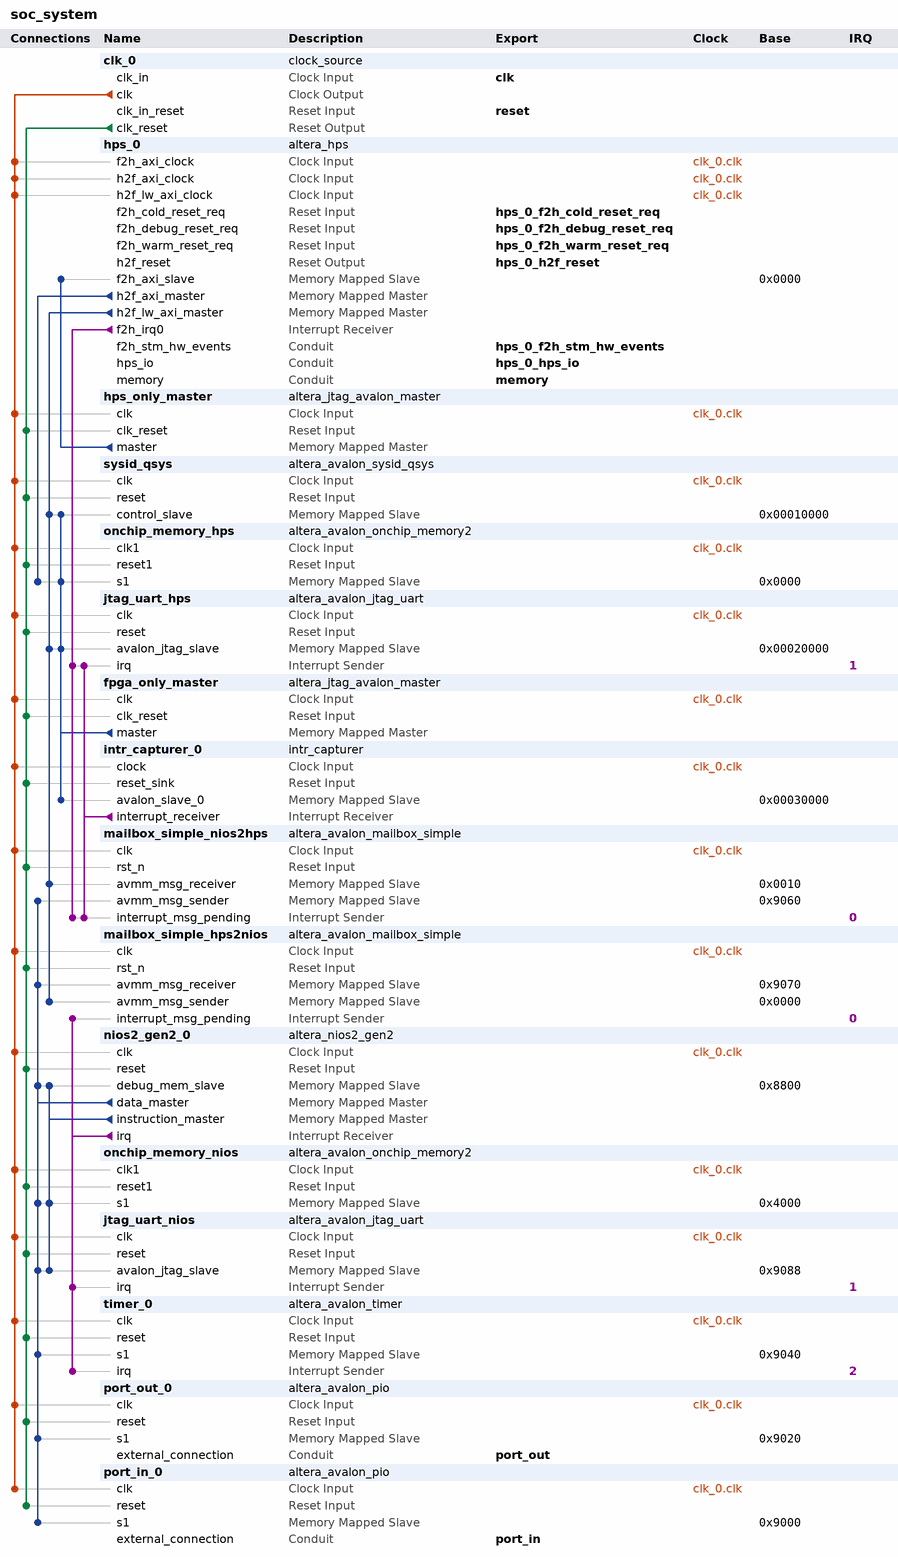
[diagram p0: system contents]
# Platform Designer (Qsys) system soc_system, Cyclone V 5CSEMA4U23C6
# Parameters at their usual value, and those the tool derives, are not listed.
package require -exact qsys 15.1
create_system soc_system
set_project_property DEVICE_FAMILY {Cyclone V}
set_project_property DEVICE 5CSEMA4U23C6

add_instance clk_0 clock_source 15.1
set_instance_parameter_value clk_0 clockFrequency 50000000

add_instance hps_0 altera_hps 15.1
set_instance_parameter_value hps_0 EMAC1_Mode RGMII
set_instance_parameter_value hps_0 EMAC1_PinMuxing {HPS I/O Set 0}
set_instance_parameter_value hps_0 F2SCLK_COLDRST_Enable true
set_instance_parameter_value hps_0 F2SCLK_DBGRST_Enable true
set_instance_parameter_value hps_0 F2SCLK_WARMRST_Enable true
set_instance_parameter_value hps_0 F2SINTERRUPT_Enable true
set_instance_parameter_value hps_0 F2S_Width 3
set_instance_parameter_value hps_0 FPGA_PERIPHERAL_OUTPUT_CLOCK_FREQ_EMAC0_GTX_CLK 100
set_instance_parameter_value hps_0 FPGA_PERIPHERAL_OUTPUT_CLOCK_FREQ_EMAC0_MD_CLK 100.0
set_instance_parameter_value hps_0 FPGA_PERIPHERAL_OUTPUT_CLOCK_FREQ_EMAC1_GTX_CLK 100
set_instance_parameter_value hps_0 FPGA_PERIPHERAL_OUTPUT_CLOCK_FREQ_EMAC1_MD_CLK 100.0
set_instance_parameter_value hps_0 HPS_PROTOCOL DDR3
set_instance_parameter_value hps_0 I2C0_Mode I2C
set_instance_parameter_value hps_0 I2C0_PinMuxing {HPS I/O Set 0}
set_instance_parameter_value hps_0 I2C1_Mode I2C
set_instance_parameter_value hps_0 I2C1_PinMuxing {HPS I/O Set 0}
set_instance_parameter_value hps_0 LWH2F_Enable true
set_instance_parameter_value hps_0 MEM_BANKADDR_WIDTH 3
set_instance_parameter_value hps_0 MEM_CLK_FREQ 400.0
set_instance_parameter_value hps_0 MEM_COL_ADDR_WIDTH 10
set_instance_parameter_value hps_0 MEM_DQ_WIDTH 32
set_instance_parameter_value hps_0 MEM_DRV_STR RZQ/6
set_instance_parameter_value hps_0 MEM_ROW_ADDR_WIDTH 15
set_instance_parameter_value hps_0 MEM_RTT_NOM RZQ/6
set_instance_parameter_value hps_0 MEM_RTT_WR {Dynamic ODT off}
set_instance_parameter_value hps_0 MEM_TCL 7
set_instance_parameter_value hps_0 MEM_TFAW_NS 37.5
set_instance_parameter_value hps_0 MEM_TRAS_NS 35.0
set_instance_parameter_value hps_0 MEM_TRCD_NS 13.75
set_instance_parameter_value hps_0 MEM_TRFC_NS 300.0
set_instance_parameter_value hps_0 MEM_TRP_NS 13.75
set_instance_parameter_value hps_0 MEM_VENDOR Other
set_instance_parameter_value hps_0 MEM_WTCL 7
set_instance_parameter_value hps_0 QSPI_Mode N/A
set_instance_parameter_value hps_0 QSPI_PinMuxing Unused
set_instance_parameter_value hps_0 REF_CLK_FREQ 25.0
set_instance_parameter_value hps_0 S2FCLK_USER2CLK 1
set_instance_parameter_value hps_0 S2F_Width 2
set_instance_parameter_value hps_0 SDIO_Mode {4-bit Data}
set_instance_parameter_value hps_0 SDIO_PinMuxing {HPS I/O Set 0}
set_instance_parameter_value hps_0 SPIM1_Mode {Single Slave Select}
set_instance_parameter_value hps_0 SPIM1_PinMuxing {HPS I/O Set 0}
set_instance_parameter_value hps_0 STM_Enable true
set_instance_parameter_value hps_0 TIMING_BOARD_AC_SKEW 0.02
set_instance_parameter_value hps_0 TIMING_BOARD_AC_TO_CK_SKEW 0.0
set_instance_parameter_value hps_0 TIMING_BOARD_DQ_TO_DQS_SKEW 0.0
set_instance_parameter_value hps_0 TIMING_BOARD_MAX_CK_DELAY 0.6
set_instance_parameter_value hps_0 TIMING_BOARD_MAX_DQS_DELAY 0.6
set_instance_parameter_value hps_0 TIMING_BOARD_SKEW_BETWEEN_DQS 0.02
set_instance_parameter_value hps_0 TIMING_BOARD_SKEW_CKDQS_DIMM_MAX 0.01
set_instance_parameter_value hps_0 TIMING_BOARD_SKEW_CKDQS_DIMM_MIN -0.01
set_instance_parameter_value hps_0 TIMING_BOARD_SKEW_WITHIN_DQS 0.02
set_instance_parameter_value hps_0 TIMING_TDH 125
set_instance_parameter_value hps_0 TIMING_TDQSCK 400
set_instance_parameter_value hps_0 TIMING_TDQSQ 120
set_instance_parameter_value hps_0 TIMING_TDS 50
set_instance_parameter_value hps_0 TIMING_TIH 250
set_instance_parameter_value hps_0 TIMING_TIS 175
set_instance_parameter_value hps_0 TIMING_TQSH 0.38
set_instance_parameter_value hps_0 UART0_Mode {No Flow Control}
set_instance_parameter_value hps_0 UART0_PinMuxing {HPS I/O Set 0}
set_instance_parameter_value hps_0 USB1_Mode SDR
set_instance_parameter_value hps_0 USB1_PinMuxing {HPS I/O Set 0}
set_instance_parameter_value hps_0 desired_cfg_clk_mhz 100.0
set_instance_parameter_value hps_0 desired_qspi_clk_mhz 370.0

add_instance hps_only_master altera_jtag_avalon_master 15.1

add_instance sysid_qsys altera_avalon_sysid_qsys 15.1
set_instance_parameter_value sysid_qsys id -1395322110

add_instance onchip_memory_hps altera_avalon_onchip_memory2 15.1
set_instance_parameter_value onchip_memory_hps dataWidth 64
set_instance_parameter_value onchip_memory_hps dualPort false
set_instance_parameter_value onchip_memory_hps initMemContent true
set_instance_parameter_value onchip_memory_hps initializationFileName onchip_memory2_0
set_instance_parameter_value onchip_memory_hps memorySize 65536

add_instance jtag_uart_hps altera_avalon_jtag_uart 15.1
set_instance_parameter_value jtag_uart_hps allowMultipleConnections true
set_instance_parameter_value jtag_uart_hps simInteractiveOptions INTERACTIVE_ASCII_OUTPUT

add_instance fpga_only_master altera_jtag_avalon_master 15.1

add_instance intr_capturer_0 intr_capturer 100.99.98.97

add_instance mailbox_simple_nios2hps altera_avalon_mailbox_simple 15.1
set_instance_parameter_value mailbox_simple_nios2hps AWIDTH 2
set_instance_parameter_value mailbox_simple_nios2hps DWIDTH 32
set_instance_parameter_value mailbox_simple_nios2hps MSG_ARRIVAL_NOTIFY 1
set_instance_parameter_value mailbox_simple_nios2hps MSG_SPACE_NOTIFY 0

add_instance mailbox_simple_hps2nios altera_avalon_mailbox_simple 15.1
set_instance_parameter_value mailbox_simple_hps2nios AWIDTH 2
set_instance_parameter_value mailbox_simple_hps2nios DWIDTH 32
set_instance_parameter_value mailbox_simple_hps2nios MSG_ARRIVAL_NOTIFY 1
set_instance_parameter_value mailbox_simple_hps2nios MSG_SPACE_NOTIFY 0

add_instance nios2_gen2_0 altera_nios2_gen2 15.1
set_instance_parameter_value nios2_gen2_0 dcache_size 2048
set_instance_parameter_value nios2_gen2_0 exceptionSlave onchip_memory_nios.s1
set_instance_parameter_value nios2_gen2_0 icache_size 4096
set_instance_parameter_value nios2_gen2_0 impl Fast
set_instance_parameter_value nios2_gen2_0 resetSlave onchip_memory_nios.s1

add_instance onchip_memory_nios altera_avalon_onchip_memory2 15.1
set_instance_parameter_value onchip_memory_nios dataWidth 32
set_instance_parameter_value onchip_memory_nios dualPort false
set_instance_parameter_value onchip_memory_nios initMemContent true
set_instance_parameter_value onchip_memory_nios initializationFileName /home/user/hps-nios-fpga/software/soc_nios/soc_nios.hex
set_instance_parameter_value onchip_memory_nios memorySize 16384
set_instance_parameter_value onchip_memory_nios useNonDefaultInitFile true

add_instance jtag_uart_nios altera_avalon_jtag_uart 15.1
set_instance_parameter_value jtag_uart_nios simInteractiveOptions NO_INTERACTIVE_WINDOWS

add_instance timer_0 altera_avalon_timer 15.1
set_instance_parameter_value timer_0 period 100
set_instance_parameter_value timer_0 periodUnits MSEC

add_instance port_out_0 altera_avalon_pio 15.1
set_instance_parameter_value port_out_0 bitModifyingOutReg true
set_instance_parameter_value port_out_0 direction Output
set_instance_parameter_value port_out_0 width 8

add_instance port_in_0 altera_avalon_pio 15.1
set_instance_parameter_value port_in_0 bitModifyingOutReg true
set_instance_parameter_value port_in_0 direction Input
set_instance_parameter_value port_in_0 width 8

# connections
add_connection clk_0.clk fpga_only_master.clk clock
add_connection clk_0.clk hps_0.f2h_axi_clock clock
add_connection clk_0.clk hps_0.h2f_axi_clock clock
add_connection clk_0.clk hps_0.h2f_lw_axi_clock clock
add_connection clk_0.clk hps_only_master.clk clock
add_connection clk_0.clk intr_capturer_0.clock clock
add_connection clk_0.clk jtag_uart_hps.clk clock
add_connection clk_0.clk jtag_uart_nios.clk clock
add_connection clk_0.clk mailbox_simple_hps2nios.clk clock
add_connection clk_0.clk mailbox_simple_nios2hps.clk clock
add_connection clk_0.clk nios2_gen2_0.clk clock
add_connection clk_0.clk onchip_memory_hps.clk1 clock
add_connection clk_0.clk onchip_memory_nios.clk1 clock
add_connection clk_0.clk port_in_0.clk clock
add_connection clk_0.clk port_out_0.clk clock
add_connection clk_0.clk sysid_qsys.clk clock
add_connection clk_0.clk timer_0.clk clock
add_connection clk_0.clk_reset fpga_only_master.clk_reset reset
add_connection clk_0.clk_reset hps_only_master.clk_reset reset
add_connection clk_0.clk_reset intr_capturer_0.reset_sink reset
add_connection clk_0.clk_reset jtag_uart_hps.reset reset
add_connection clk_0.clk_reset jtag_uart_nios.reset reset
add_connection clk_0.clk_reset mailbox_simple_hps2nios.rst_n reset
add_connection clk_0.clk_reset mailbox_simple_nios2hps.rst_n reset
add_connection clk_0.clk_reset nios2_gen2_0.reset reset
add_connection clk_0.clk_reset onchip_memory_hps.reset1 reset
add_connection clk_0.clk_reset onchip_memory_nios.reset1 reset
add_connection clk_0.clk_reset port_in_0.reset reset
add_connection clk_0.clk_reset port_out_0.reset reset
add_connection clk_0.clk_reset sysid_qsys.reset reset
add_connection clk_0.clk_reset timer_0.reset reset
add_connection fpga_only_master.master intr_capturer_0.avalon_slave_0 avalon
set_connection_parameter_value fpga_only_master.master/intr_capturer_0.avalon_slave_0 baseAddress 0x00030000
add_connection fpga_only_master.master jtag_uart_hps.avalon_jtag_slave avalon
set_connection_parameter_value fpga_only_master.master/jtag_uart_hps.avalon_jtag_slave baseAddress 0x00020000
add_connection fpga_only_master.master onchip_memory_hps.s1 avalon
set_connection_parameter_value fpga_only_master.master/onchip_memory_hps.s1 baseAddress 0x0000
add_connection fpga_only_master.master sysid_qsys.control_slave avalon
set_connection_parameter_value fpga_only_master.master/sysid_qsys.control_slave baseAddress 0x00010000
add_connection hps_0.h2f_axi_master onchip_memory_hps.s1 avalon
set_connection_parameter_value hps_0.h2f_axi_master/onchip_memory_hps.s1 baseAddress 0x0000
add_connection hps_0.h2f_lw_axi_master jtag_uart_hps.avalon_jtag_slave avalon
set_connection_parameter_value hps_0.h2f_lw_axi_master/jtag_uart_hps.avalon_jtag_slave baseAddress 0x00020000
add_connection hps_0.h2f_lw_axi_master mailbox_simple_hps2nios.avmm_msg_sender avalon
set_connection_parameter_value hps_0.h2f_lw_axi_master/mailbox_simple_hps2nios.avmm_msg_sender baseAddress 0x0000
add_connection hps_0.h2f_lw_axi_master mailbox_simple_nios2hps.avmm_msg_receiver avalon
set_connection_parameter_value hps_0.h2f_lw_axi_master/mailbox_simple_nios2hps.avmm_msg_receiver baseAddress 0x0010
add_connection hps_0.h2f_lw_axi_master sysid_qsys.control_slave avalon
set_connection_parameter_value hps_0.h2f_lw_axi_master/sysid_qsys.control_slave baseAddress 0x00010000
add_connection hps_only_master.master hps_0.f2h_axi_slave avalon
set_connection_parameter_value hps_only_master.master/hps_0.f2h_axi_slave baseAddress 0x0000
add_connection nios2_gen2_0.data_master jtag_uart_nios.avalon_jtag_slave avalon
set_connection_parameter_value nios2_gen2_0.data_master/jtag_uart_nios.avalon_jtag_slave baseAddress 0x9088
add_connection nios2_gen2_0.data_master mailbox_simple_hps2nios.avmm_msg_receiver avalon
set_connection_parameter_value nios2_gen2_0.data_master/mailbox_simple_hps2nios.avmm_msg_receiver baseAddress 0x9070
add_connection nios2_gen2_0.data_master mailbox_simple_nios2hps.avmm_msg_sender avalon
set_connection_parameter_value nios2_gen2_0.data_master/mailbox_simple_nios2hps.avmm_msg_sender baseAddress 0x9060
add_connection nios2_gen2_0.data_master nios2_gen2_0.debug_mem_slave avalon
set_connection_parameter_value nios2_gen2_0.data_master/nios2_gen2_0.debug_mem_slave baseAddress 0x8800
add_connection nios2_gen2_0.data_master onchip_memory_nios.s1 avalon
set_connection_parameter_value nios2_gen2_0.data_master/onchip_memory_nios.s1 baseAddress 0x4000
add_connection nios2_gen2_0.data_master port_in_0.s1 avalon
set_connection_parameter_value nios2_gen2_0.data_master/port_in_0.s1 baseAddress 0x9000
add_connection nios2_gen2_0.data_master port_out_0.s1 avalon
set_connection_parameter_value nios2_gen2_0.data_master/port_out_0.s1 baseAddress 0x9020
add_connection nios2_gen2_0.data_master timer_0.s1 avalon
set_connection_parameter_value nios2_gen2_0.data_master/timer_0.s1 baseAddress 0x9040
add_connection nios2_gen2_0.instruction_master jtag_uart_nios.avalon_jtag_slave avalon
set_connection_parameter_value nios2_gen2_0.instruction_master/jtag_uart_nios.avalon_jtag_slave baseAddress 0x9088
add_connection nios2_gen2_0.instruction_master nios2_gen2_0.debug_mem_slave avalon
set_connection_parameter_value nios2_gen2_0.instruction_master/nios2_gen2_0.debug_mem_slave baseAddress 0x8800
add_connection nios2_gen2_0.instruction_master onchip_memory_nios.s1 avalon
set_connection_parameter_value nios2_gen2_0.instruction_master/onchip_memory_nios.s1 baseAddress 0x4000
add_connection hps_0.f2h_irq0 jtag_uart_hps.irq interrupt
set_connection_parameter_value hps_0.f2h_irq0/jtag_uart_hps.irq irqNumber 1
add_connection hps_0.f2h_irq0 mailbox_simple_nios2hps.interrupt_msg_pending interrupt
set_connection_parameter_value hps_0.f2h_irq0/mailbox_simple_nios2hps.interrupt_msg_pending irqNumber 0
add_connection intr_capturer_0.interrupt_receiver jtag_uart_hps.irq interrupt
set_connection_parameter_value intr_capturer_0.interrupt_receiver/jtag_uart_hps.irq irqNumber 1
add_connection intr_capturer_0.interrupt_receiver mailbox_simple_nios2hps.interrupt_msg_pending interrupt
set_connection_parameter_value intr_capturer_0.interrupt_receiver/mailbox_simple_nios2hps.interrupt_msg_pending irqNumber 0
add_connection nios2_gen2_0.irq jtag_uart_nios.irq interrupt
set_connection_parameter_value nios2_gen2_0.irq/jtag_uart_nios.irq irqNumber 1
add_connection nios2_gen2_0.irq mailbox_simple_hps2nios.interrupt_msg_pending interrupt
set_connection_parameter_value nios2_gen2_0.irq/mailbox_simple_hps2nios.interrupt_msg_pending irqNumber 0
add_connection nios2_gen2_0.irq timer_0.irq interrupt
set_connection_parameter_value nios2_gen2_0.irq/timer_0.irq irqNumber 2

# exported interfaces
add_interface clk clock sink
set_interface_property clk EXPORT_OF clk_0.clk_in
add_interface hps_0_f2h_cold_reset_req reset sink
set_interface_property hps_0_f2h_cold_reset_req EXPORT_OF hps_0.f2h_cold_reset_req
add_interface hps_0_f2h_debug_reset_req reset sink
set_interface_property hps_0_f2h_debug_reset_req EXPORT_OF hps_0.f2h_debug_reset_req
add_interface hps_0_f2h_stm_hw_events conduit end
set_interface_property hps_0_f2h_stm_hw_events EXPORT_OF hps_0.f2h_stm_hw_events
add_interface hps_0_f2h_warm_reset_req reset sink
set_interface_property hps_0_f2h_warm_reset_req EXPORT_OF hps_0.f2h_warm_reset_req
add_interface hps_0_h2f_reset reset source
set_interface_property hps_0_h2f_reset EXPORT_OF hps_0.h2f_reset
add_interface hps_0_hps_io conduit end
set_interface_property hps_0_hps_io EXPORT_OF hps_0.hps_io
add_interface memory conduit end
set_interface_property memory EXPORT_OF hps_0.memory
add_interface port_in conduit end
set_interface_property port_in EXPORT_OF port_in_0.external_connection
add_interface port_out conduit end
set_interface_property port_out EXPORT_OF port_out_0.external_connection
add_interface reset reset sink
set_interface_property reset EXPORT_OF clk_0.clk_in_reset

set_interconnect_requirement {$system} qsys_mm.clockCrossingAdapter HANDSHAKE
set_interconnect_requirement {$system} qsys_mm.maxAdditionalLatency 1

save_system soc_system.qsys
